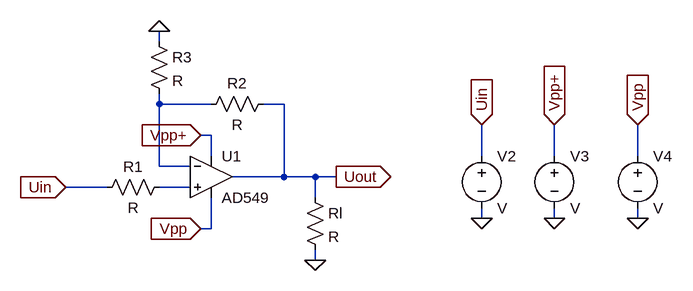
[diagram p0: schematic Draft4.asc]
Draft4.asc, the LTspice schematic file:
Version 4
SHEET 1 1072 680
WIRE 112 -16 112 -32
WIRE 112 80 112 64
WIRE 192 80 112 80
WIRE 304 80 272 80
WIRE 192 128 176 128
WIRE 192 160 192 128
WIRE 608 160 608 112
WIRE 720 160 720 112
WIRE 848 160 848 112
WIRE 112 176 112 80
WIRE 160 176 112 176
WIRE 304 192 304 80
WIRE 304 192 224 192
WIRE 352 192 304 192
WIRE 384 192 352 192
WIRE 32 208 -32 208
WIRE 160 208 112 208
WIRE 352 224 352 192
WIRE 608 256 608 240
WIRE 720 256 720 240
WIRE 848 256 848 240
WIRE 192 272 192 224
WIRE 192 272 176 272
WIRE 352 320 352 304
FLAG -32 208 Uin
IOPIN -32 208 In
FLAG 112 -32 0
FLAG 384 192 Uout
IOPIN 384 192 Out
FLAG 352 320 0
FLAG 608 112 Uin
IOPIN 608 112 In
FLAG 176 128 Vpp+
IOPIN 176 128 In
FLAG 720 112 Vpp+
IOPIN 720 112 In
FLAG 176 272 Vpp
IOPIN 176 272 In
FLAG 848 112 Vpp
IOPIN 848 112 In
FLAG 608 256 0
FLAG 720 256 0
FLAG 848 256 0
SYMBOL OpAmps\\AD549 192 128 R0
SYMATTR InstName U1
SYMBOL res 128 192 R90
WINDOW 0 0 56 VBottom 2
WINDOW 3 32 56 VTop 2
SYMATTR InstName R1
SYMBOL res 96 -32 R0
SYMATTR InstName R3
SYMBOL res 288 64 R90
WINDOW 0 0 56 VBottom 2
WINDOW 3 32 56 VTop 2
SYMATTR InstName R2
SYMBOL res 336 208 R0
SYMATTR InstName Rl
SYMBOL voltage 608 144 R0
SYMATTR InstName V2
SYMBOL voltage 720 144 R0
SYMATTR InstName V3
SYMBOL voltage 848 144 R0
SYMATTR InstName V4

The netlist it stands for:
* Draft4.asc
XU1 N002 N001 Vpp+ Vpp Uout AD549  ; pins In+ In- V+ V- OUT
R1 N002 Uin R
R3 0 N001 R
R2 Uout N001 R
Rl Uout 0 R
V2 Uin 0 V
V3 Vpp+ 0 V
V4 Vpp 0 V
.backanno
.end